# Altium project Ejemplo8.PrjPcb
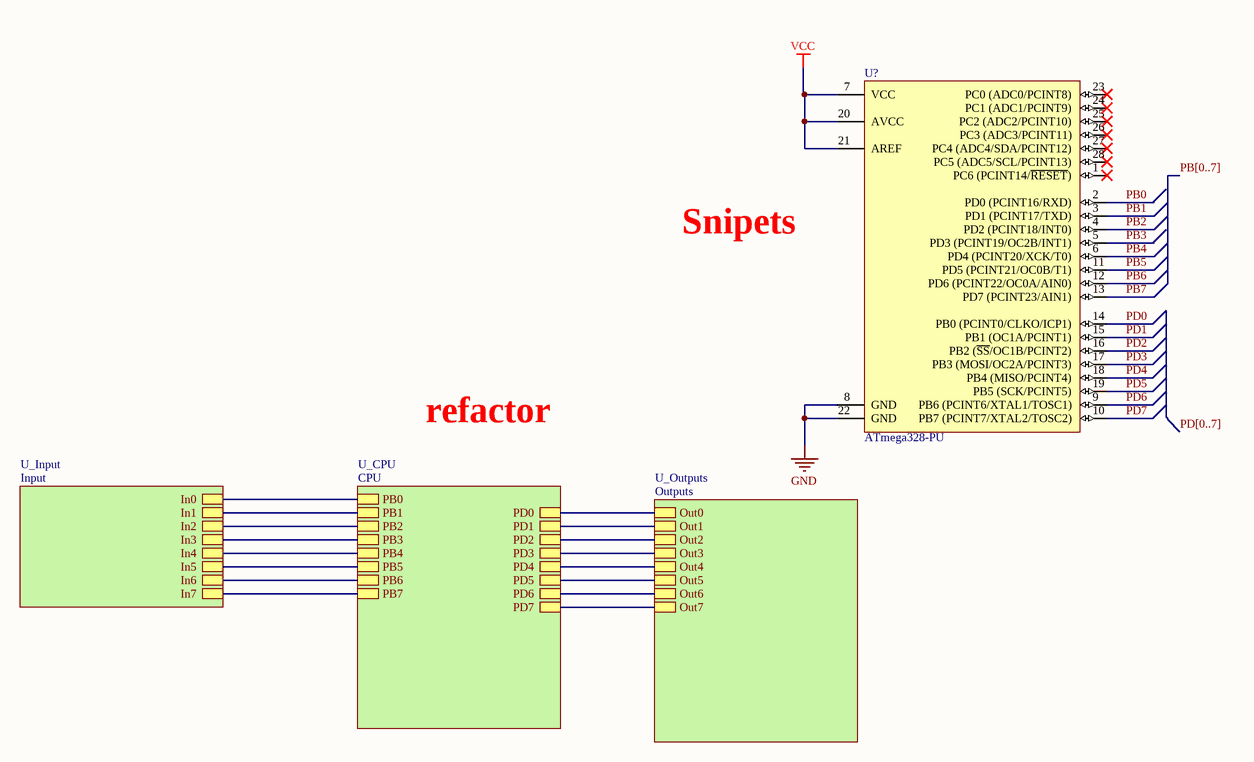
[diagram p0: Sheet3.SchDoc]
1 sheet, 1 parts. Net scope: hierarchical (ports join the sheet entries above them; power ports are global).
Board file: PCB3.PcbDoc

## Sheet Sheet3.SchDoc
size A4; SheetNumber: 1; SheetTotal: 4

### Parts
U?  ATmega328-PU  [28P3]

### Sub-sheets
U_CPU = CPU (file not in this document): PB0, PB1, PB2, PB3, PB4, PB5, PB6, PB7, PD0, PD1, PD2, PD3, PD4, PD5, PD6, PD7
U_Input = Input (file not in this document): In0, In1, In2, In3, In4, In5, In6, In7
U_Outputs = Outputs (file not in this document): Out0, Out1, Out2, Out3, Out4, Out5, Out6, Out7

### Nets
GND: U?.8(GND) U?.22(GND)
VCC: U?.7(VCC) U?.20(AVCC) U?.21(AREF)
PB0: U?.2(PD0_(PCINT16/RXD))
PB1: U?.3(PD1_(PCINT17/TXD))
PB2: U?.4(PD2_(PCINT18/INT0))
PB3: U?.5(PD3_(PCINT19/OC2B/INT1))
PB4: U?.6(PD4_(PCINT20/XCK/T0))
PB5: U?.11(PD5_(PCINT21/OC0B/T1))
PB6: U?.12(PD6_(PCINT22/OC0A/AIN0))
PB7: U?.13(PD7_(PCINT23/AIN1))
PD0: U?.14(PB0_(PCINT0/CLKO/ICP1))
PD1: U?.15(PB1_(OC1A/PCINT1))
PD2: U?.16(PB2_(~{SS}/OC1B/PCINT2))
PD3: U?.17(PB3_(MOSI/OC2A/PCINT3))
PD4: U?.18(PB4_(MISO/PCINT4))
PD5: U?.19(PB5_(SCK/PCINT5))
PD6: U?.9(PB6_(PCINT6/XTAL1/TOSC1))
PD7: U?.10(PB7_(PCINT7/XTAL2/TOSC2))
(unnamed): sheet U_CPU/PB0, sheet U_Input/In0
(unnamed): sheet U_CPU/PB1, sheet U_Input/In1
(unnamed): sheet U_CPU/PB2, sheet U_Input/In2
(unnamed): sheet U_CPU/PB3, sheet U_Input/In3
(unnamed): sheet U_CPU/PB4, sheet U_Input/In4
(unnamed): sheet U_CPU/PB5, sheet U_Input/In5
(unnamed): sheet U_CPU/PB6, sheet U_Input/In6
(unnamed): sheet U_CPU/PB7, sheet U_Input/In7
(unnamed): sheet U_CPU/PD0, sheet U_Outputs/Out0
(unnamed): sheet U_CPU/PD1, sheet U_Outputs/Out1
(unnamed): sheet U_CPU/PD2, sheet U_Outputs/Out2
(unnamed): sheet U_CPU/PD3, sheet U_Outputs/Out3
(unnamed): sheet U_CPU/PD4, sheet U_Outputs/Out4
(unnamed): sheet U_CPU/PD5, sheet U_Outputs/Out5
(unnamed): sheet U_CPU/PD6, sheet U_Outputs/Out6
(unnamed): sheet U_CPU/PD7, sheet U_Outputs/Out7

Not connected (* = marked no-connect by the designer): U? 1(PC6_(PCINT14/~{RESET}))* 23(PC0_(ADC0/PCINT8))* 24(PC1_(ADC1/PCINT9))* 25(PC2_(ADC2/PCINT10))* 26(PC3_(ADC3/PCINT11))* 27(PC4_(ADC4/SDA/PCINT12))* 28(PC5_(ADC5/SCL/PCINT13))*

### Buses and harness runs
bus PB[0..7]
bus PD[0..7]

### Notes on the sheet
- Snipets
- refactor

### Library data of the parts
U? = CMP-0095-00015-2: 8-bit AVR Microcontroller, 32KB Flash, 1KB EEPROM, 2KB SRAM, 28-pin PDIP, Industrial Grade (-40°C to 85°C); ComponentLink3Description: ATmega48A/48PA/88A/88PA/168A/168PA/328/328P Summary; RevisionNote: DatasheetVersion updated. URLs added.; DatasheetVersion: revD, May-2011; ComponentLink1URL: http://www.atmel.com/; PackageVersion: revB, Sep-2001; PackageDescription: 28-lead (0.300"/7.62mm Wide) Plastic Dual Inline Package (PDIP); PackageReference: 28P3; ComponentLink1Description: Manufacturer URL; ComponentLink2Description: ATmega48A/48PA/88A/88PA/168A/168PA/328/328P Datasheet; ComponentLink3URL: http://www.atmel.com/dyn/resources/prod_documents/8271S.pdf; ComponentLink2URL: http://www.atmel.com/dyn/resources/prod_documents/8271.pdf